# Altium project RS232-MITM.PrjPCB
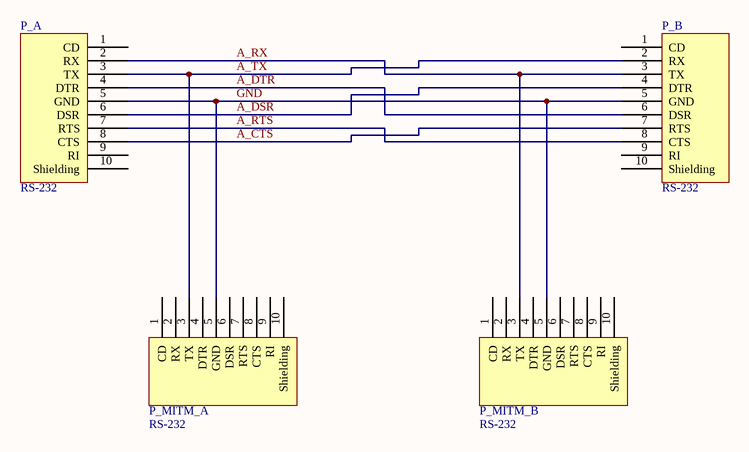
[diagram p0: Top.SchDoc]
1 sheet, 4 parts. Net scope: global (net labels, ports and power ports of the same name join across sheets).
Board file: PCB.PcbDoc

## Sheet Top.SchDoc
size A4

### Parts
P_A  RS-232  [RS232 SMD male]
P_B  RS-232  [RS232 SMD male]
P_MITM_A  RS-232  [RS232 SMD male]
P_MITM_B  RS-232  [RS232 SMD male]

### Nets
A_CTS: P_A.8(CTS) P_B.7(RTS)
A_DSR: P_A.6(DSR) P_B.4(DTR)
A_DTR: P_A.4(DTR) P_B.6(DSR)
A_RTS: P_A.7(RTS) P_B.8(CTS)
A_RX: P_A.2(RX) P_B.3(TX) P_MITM_B.3(TX)
A_TX: P_A.3(TX) P_B.2(RX) P_MITM_A.3(TX)
GND: P_A.5(GND) P_B.5(GND) P_MITM_A.5(GND) P_MITM_B.5(GND)

Not connected (* = marked no-connect by the designer): P_A 1(CD) 9(RI) 10(Shielding); P_B 1(CD) 9(RI) 10(Shielding); P_MITM_A 1(CD) 2(RX) 4(DTR) 6(DSR) 7(RTS) 8(CTS) 9(RI) 10(Shielding); P_MITM_B 1(CD) 2(RX) 4(DTR) 6(DSR) 7(RTS) 8(CTS) 9(RI) 10(Shielding)